# Altium schematic sheet USBC-US-Conn.SchDoc
size A3
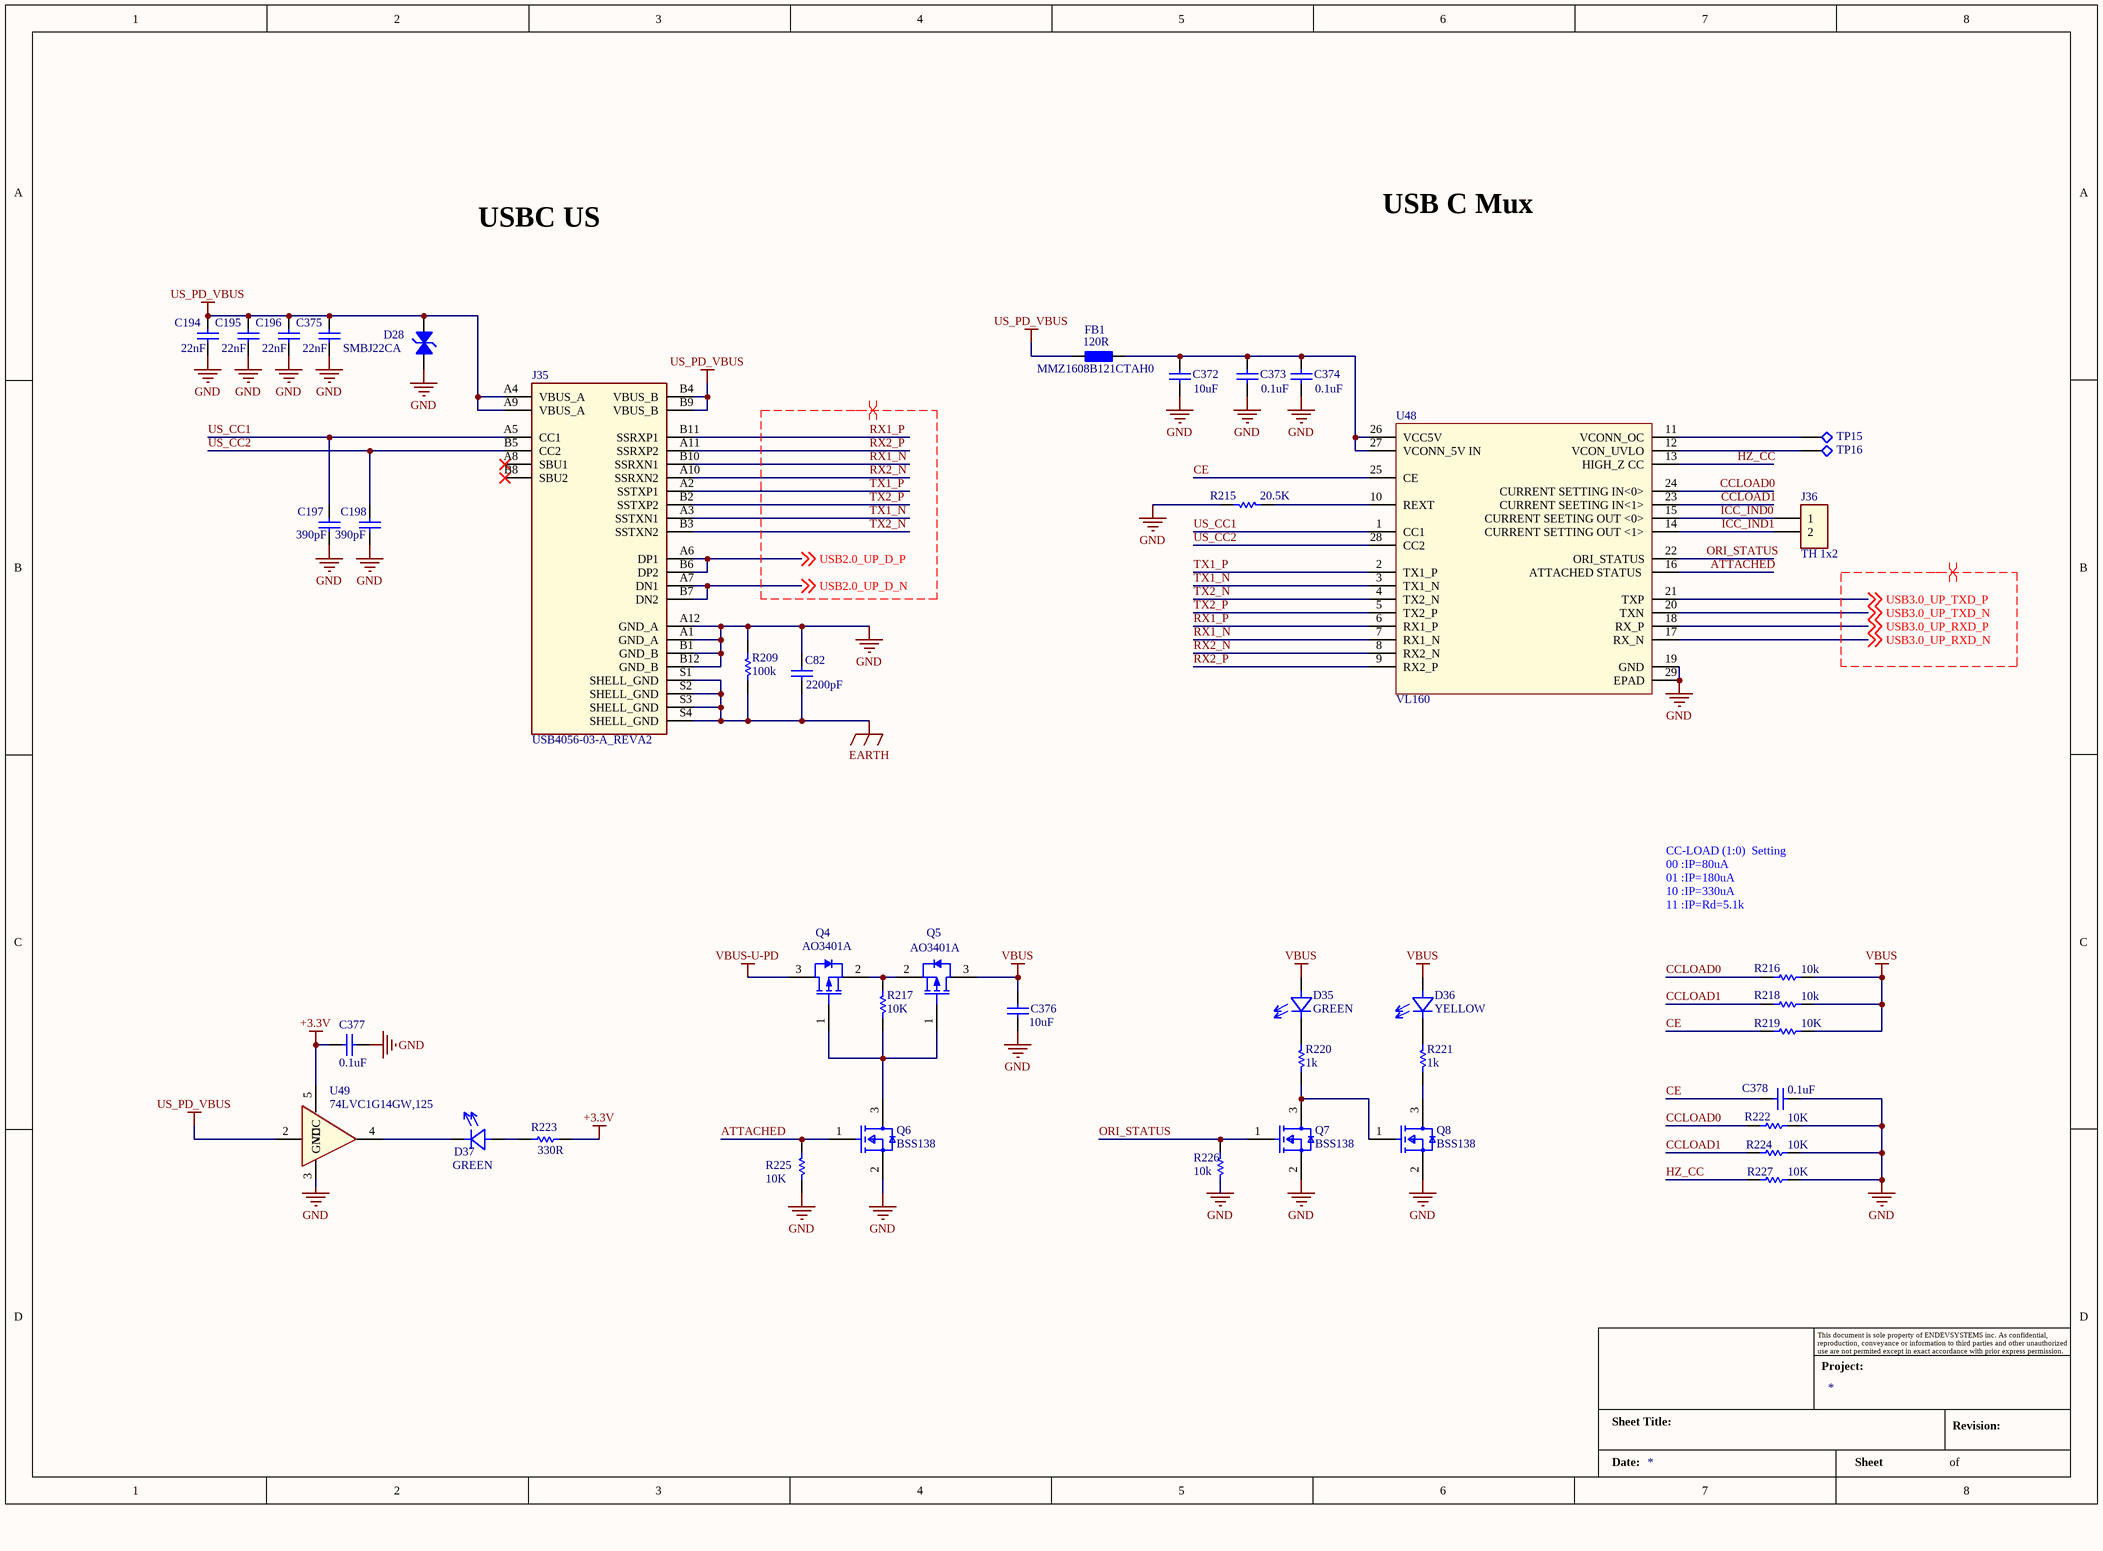
[diagram p0: USBC-US-Conn.SchDoc]

## Parts
?  Title_Block  (value not drawn)  (graphical)
C82  2200pF  [C-0603/1608]
C194  22nF  [C-0805/2012]
C195  22nF  [C-0805/2012]
C196  22nF  [C-0805/2012]
C197  390pF  [C-0805/2012]
C198  390pF  [C-0805/2012]
C372  10uF  [C-0402/1005]
C373  0.1uF  [C-0402/1005]
C374  0.1uF  [C-0402/1005]
C375  22nF  [C-0805/2012]
C376  10uF  [C-0805/2012]
C377  0.1uF  [C-0402/1005]
C378  0.1uF  [C-0402/1005]
D28  SMBJ22CA  [DO-214AA\SMB]
D35  GREEN  [LEDC1608X65N]
D36  YELLOW  [LEDC1608X65N]
D37  GREEN  [LEDC1608X65N]
FB1  MMZ1608B121CTAH0  value 120R  [R-0603/1608]
J35  USB4056-03-A_REVA2  [GCT_USB4056-03-A_REVA2]
J36  TH 1x2  [PIN HEADER 1x2 2.54mm]
Q4  AO3401A  [AO-SOT-23-3L_V]
Q5  AO3401A  [AO-SOT-23-3L_V]
Q6  BSS138  [FP-318-08-IPC_B]
Q7  BSS138  [FP-318-08-IPC_B]
Q8  BSS138  [FP-318-08-IPC_B]
R209  100k  [R-0603/1608]
R215  20.5K  [R-0402/1005]
R216  10k  [R-0402/1005]
R217  10K  [R-0402/1005]
R218  10k  [R-0402/1005]
R219  10K  [R-0402/1005]
R220  1k  [R-0402/1005]
R221  1k  [R-0402/1005]
R222  10K  [R-0402/1005]
R223  330R  [R-0402/1005]
R224  10K  [R-0402/1005]
R225  10K  [R-0402/1005]
R226  10k  [R-0402/1005]
R227  10K  [R-0402/1005]
TP15  Test Points  [Test Point TH Round H0.9,D1.6]  (value not drawn)
TP16  Test Points  [Test Point TH Round H0.9,D1.6]  (value not drawn)
U48  VL160  [VL160]
U49  74LVC1G14GW,125  [SOT65P212X110-5N]

## Nets
+3.3V: C377.2 R223.2 U49.5(VCC)
EARTH: C82.1 J35.S1(SHELL_GND) J35.S2(SHELL_GND) J35.S3(SHELL_GND) J35.S4(SHELL_GND) R209.1
GND: C82.2 C194.1 C195.1 C196.1 C197.1 C198.1 C372.1 C373.1 C374.1 C375.1 C376.1 C377.1 C378.2 D28.1 J35.A1(GND_A) J35.A12(GND_A) J35.B1(GND_B) J35.B12(GND_B) Q6.2(S) Q7.2(S) Q8.2(S) R209.2 R215.1 R222.1 R224.1 R225.1 R226.1 R227.1 U48.19(GND) U48.29(EPAD) U49.3(GND)
US_PD_VBUS: C194.2 C195.2 C196.2 C375.2 D28.2 FB1.2 J35.A4(VBUS_A) J35.A9(VBUS_A) J35.B4(VBUS_B) J35.B9(VBUS_B) U49.2(A)
VBUS: C376.2 D35.A D36.A Q5.3(DRAIN) R216.1 R218.1 R219.1
VBUS-U-PD: Q4.3(DRAIN)
ATTACHED: Q6.1(G) R225.2 U48.16(ATTACHED_STATUS)
CCLOAD0: R216.2 R222.2 U48.24(CURRENT_SETTING_IN<0>)
CCLOAD1: R218.2 R224.2 U48.23(CURRENT_SEETING_IN<1>)
CE: C378.1 R219.2 U48.25(CE)
HZ_CC: R227.2 U48.13(HIGH_Z_CC)
ICC_IND0: J36.1 U48.15(CURRENT_SEETING_OUT_<0>)
ICC_IND1: J36.2 U48.14(CURRENT_SETTING_OUT_<1>)
ORI_STATUS: Q7.1(G) R226.2 U48.22(ORI_STATUS)
RX1_N: J35.B10(SSRXN1) U48.7(RX1_N)
RX1_P: J35.B11(SSRXP1) U48.6(RX1_P)
RX2_N: J35.A10(SSRXN2) U48.8(RX2_N)
RX2_P: J35.A11(SSRXP2) U48.9(RX2_P)
TX1_N: J35.A3(SSTXN1) U48.3(TX1_N)
TX1_P: J35.A2(SSTXP1) U48.2(TX1_P)
TX2_N: J35.B3(SSTXN2) U48.4(TX2_N)
TX2_P: J35.B2(SSTXP2) U48.5(TX2_P)
US_CC1: C197.2 J35.A5(CC1) U48.1(CC1)
US_CC2: C198.2 J35.B5(CC2) U48.28(CC2)
USB2.0_UP_D_N: J35.A7(DN1) J35.B7(DN2) ; off-sheet USB2.0_UP_D_N
USB2.0_UP_D_P: J35.A6(DP1) J35.B6(DP2) ; off-sheet USB2.0_UP_D_P
USB3.0_UP_RXD_N: U48.17(RX_N) ; off-sheet USB3.0_UP_RXD_N
USB3.0_UP_RXD_P: U48.18(RX_P) ; off-sheet USB3.0_UP_RXD_P
USB3.0_UP_TXD_N: U48.20(TXN) ; off-sheet USB3.0_UP_TXD_N
USB3.0_UP_TXD_P: U48.21(TXP) ; off-sheet USB3.0_UP_TXD_P
NetC372_2: C372.2 C373.2 C374.2 FB1.1 U48.26(VCC5V) U48.27(VCONN_5V_IN)
NetD35_C: D35.C R220.2
NetD36_C: D36.C R221.2
NetD37_A: D37.A R223.1
NetD37_C: D37.C U49.4(~{Y})
NetQ4_1: Q4.1(GATE) Q5.1(GATE) Q6.3(D) R217.1
NetQ4_2: Q4.2(SOURCE) Q5.2(SOURCE) R217.2
NetQ7_3: Q7.3(D) Q8.1(G) R220.1
NetQ8_3: Q8.3(D) R221.1
NetR215_2: R215.2 U48.10(REXT)
NetTP15_1: TP15.1 U48.11(VCONN_OC)
NetTP16_1: TP16.1 U48.12(VCON_UVLO)

Not connected (* = marked no-connect by the designer): J35 A8(SBU1)* B8(SBU2)*

## Layout directives
differential pair; differential pair class Diff_90R: RX1_N, RX1_P, RX2_N, RX2_P, TX1_N, TX1_P, TX2_N, TX2_P, USB2.0_UP_D_N, USB2.0_UP_D_P, USB3.0_UP_RXD_N, USB3.0_UP_RXD_P, USB3.0_UP_TXD_N, USB3.0_UP_TXD_P

## Notes on the sheet
- USBC US
- USB C Mux
- CC-LOAD (1:0)  Setting
  00 :IP=80uA
  01 :IP=180uA
  10 :IP=330uA
  11 :IP=Rd=5.1k
- (in symbol Title_Block) This document is sole property of ENDEVSYSTEMS inc. As confidential, reproduction, conveyance or information to third parties and other unauthorized use are not permited except in exact accordance with prior express permission.; Project:; Sheet Title:; Revision:; Date:; Sheet; of

## Library data of the parts
C82 C194-C198 C372 C375 C376 = Cap: Capacitor; Value: 0.1uF; Published: 8-Jun-2000; LatestRevisionDate: 17-Jul-2002; LatestRevisionNote: Re-released for DXP Platform.; PackageReference: RAD-0.3; Publisher: Altium Limited; PackageDescription: Radial Cap, Thru-Hole; 2 Leads; 0.3 in Pin Spacing
C373 C374 C377 C378 = Cap: Capacitor; Published: 8-Jun-2000; LatestRevisionDate: 17-Jul-2002; LatestRevisionNote: Re-released for DXP Platform.; PackageReference: RAD-0.3; Publisher: Altium Limited; PackageDescription: Radial Cap, Thru-Hole; 2 Leads; 0.3 in Pin Spacing; Value: 0.1uF
D28 = ACPDQC3V3T-HF: TVS DIODE 3.3V 9.8V 0402C; Unit Price (USD): 0.41; Mfr. Part No.: ACPDQC3V3T-HF; Supplier Part No.: 641-1635-1-ND; Supplier: Digikey Electronics
D35-D37 = Diode-LED: Supplier: Digikey Electronics
FB1 = BLM15H: FERRITE BEAD 120 OHM 0402 1LN; Mfr. Part No.: BLM15HB121SN1D; Unit Price (USD): 0.19; Supplier Part No.: 490-4000-1-ND; Supplier: Digikey Electronics
J35 = USB4056-03-A_REVA2: USB-C (USB TYPE-C) USB 3.2 Gen 2 (USB 3.1 Gen 2, Superspeed + (USB 3.1)) Receptacle Connector 24 Position Surface Mount, Right Angle; Through Hole; MF: Global Connector Technology; Package: None; Check_prices: https://www.snapeda.com/parts/USB4056-03-A/Global+Connector+Technology/view-part/?ref=eda; Value: *; Availability: In Stock; SnapEDA_Link: https://www.snapeda.com/parts/USB4056-03-A/Global+Connector+Technology/view-part/?ref=snap; MP: USB4056-03-A; Price: None
J36 = Header 1x2: CONN HEADER VERT 3POS 2.54MM; Mfr. Part No.: 75160-156-03LF; Value: 51R; Unit Price (USD): 0.74; Supplier Part No.: 609-75160-156-03LF-ND; Supplier: Digikey Electronics
Q4 Q5 = CMP-2000-05778-1: P-Channel MOSFET, 30 V, 4 A, -55 to 150 degC, 3-Pin SOT-23-3L, RoHS, Tape and Reel; Manufacturer: Alpha and Omega; Output Power (Max): NotRequiredW; Power Dissipation: 1.4W; Rad Hardened: No; Drain Efficiency: NotRequired%; Drain-Source On-Volt: 30V; Noise Figure: NotRequireddB; Frequency (Max): NotRequiredMHz; Number of  Elements: 1; Gate-Source Voltage (Max): ?12V; Drain Current (Max): 4A; Channel Mode: Enhancement; Drain-Source On-Res: 0.044ohm; Type: PowerMOSFET; Polarity: P; Package URL: http://www.aosmd.com/res/packaging_information/SOT-23-3L.pdf; Datasheet URL: http://www.aosmd.com/res/data_sheets/AO3401A.pdf; Package Type: SOT-23; Package Description: 3-Pin Small Outline Transistor, Body 2.95 x 1.6 mm, Pitch 0.95 mm; Mounting: SurfaceMount; Manufacturer URL: http://www.aosmd.com/; Continuous Drain Current: 4A; Package Reference: SOT-23-3L; Mounting Technology: SurfaceMount; Operating Temperature Classification: Military; Power Gain: NotRequireddB; Datasheet Version: Rev. 3, 03/2011; Operating Temp Range: -55Cto150C; Pin Count: 3
Q6-Q8 = CMP-07173-000101-1: MOSFET N-CH 50V 220MA SOT-23; Turn-Off Delay Time: 20ns; Element Configuration: Single; Rds On Max: 3.5R; Gate to Source Voltage (Vgs): 20V; Threshold Voltage: 1.3V; Number of Elements: 1; Power Dissipation: 360mW; Rise Time: 9ns; Turn-On Delay Time: 2.5ns; Input Capacitance: 27pF; On-State Resistance: 6R; Lead Free: Lead Free; Length: 2.92mm; Width: 1.3mm; Drain to Source Breakdown Voltage: 50V; Min Operating Temperature: -55°C; REACH SVHC: No SVHC; Packaging: Tape and Reel; Radiation Hardening: No; Height: 0.93mm; Drain to Source Voltage (Vdss): 50V; Current Rating: 220mA; Voltage Rating (DC): 50V; Weight: 0.03g; Continuous Drain Current (ID): 220mA; Number of Pins: 3; Nominal Vgs: 1.3V; Max Power Dissipation: 360mW; Fall Time: 9ns; Drain to Source Resistance: 3.5R; Contact Plating: Tin; Case/Package: SOT-23; Package Quantity: 1; Dual Supply Voltage: 50V; Mount: Surface Mount; Termination: SMD/SMT; Max Operating Temperature: 150°C
R209 R215 R220 R221 R223 = Res1: Resistor; Value: 10K; Published: 8-Jun-2000; LatestRevisionDate: 17-Jul-2002; LatestRevisionNote: Re-released for DXP Platform.; PackageReference: AXIAL-0.3; Publisher: Altium Limited; PackageDescription: Axial Device, Thru-Hole; 2 Leads; 0.3 in Pin Spacing
R216-R219 R222 R224-R227 = Res1: Resistor; Published: 8-Jun-2000; LatestRevisionDate: 17-Jul-2002; LatestRevisionNote: Re-released for DXP Platform.; PackageReference: AXIAL-0.3; Publisher: Altium Limited; PackageDescription: Axial Device, Thru-Hole; 2 Leads; 0.3 in Pin Spacing; Value: 10K
U49 = 74LVC1G14GW,125: Inverter Schmitt Trigger 1-Element CMOS 5-Pin TSSOP T/R; Price: None; Availability: Unavailable; MP: 74LVC1G14GW,125; Value: *; Package: None
? = Title_Block: Date:: *; Project:: *